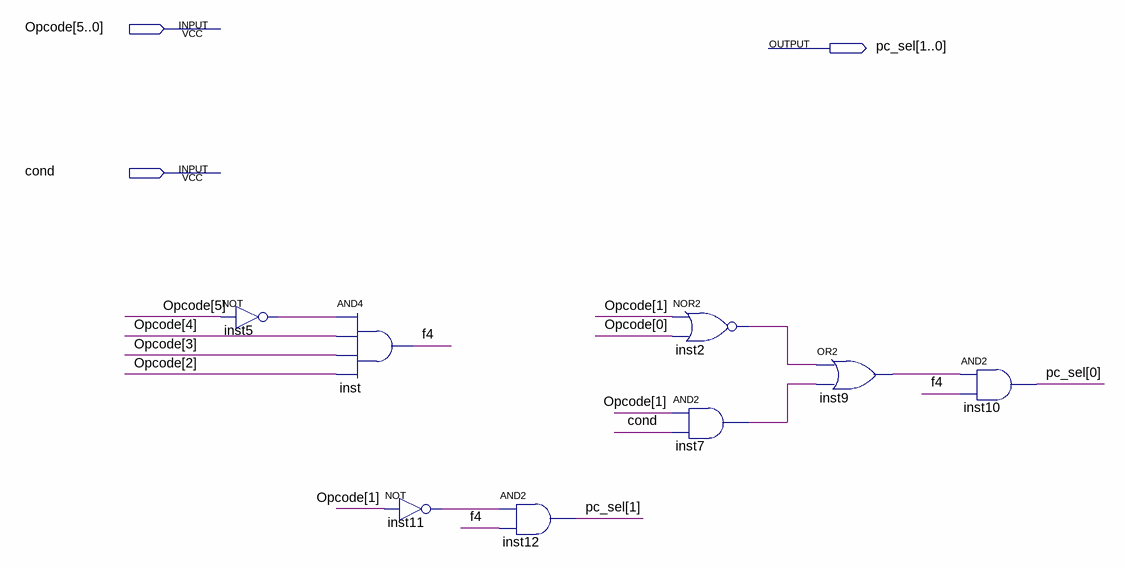
[diagram p0: schematic sheet]
// Quartus schematic PC_selector.bdf as structural Verilog: 8 symbols, 3 pins
module PC_selector (
  input  [5:0] Opcode,
  input  cond,
  output [1:0] pc_sel
);

  wire f4, inst2_out, inst5_out, inst7_out, inst9_out, inst11_out;

  not inst5 (inst5_out, Opcode[5]);
  and inst (f4, inst5_out, Opcode[4], Opcode[3], Opcode[2]);
  not inst11 (inst11_out, Opcode[1]);
  and inst12 (pc_sel[1], inst11_out, f4);
  nor inst2 (inst2_out, Opcode[1], Opcode[0]);
  and inst7 (inst7_out, Opcode[1], cond);
  or inst9 (inst9_out, inst2_out, inst7_out);
  and inst10 (pc_sel[0], inst9_out, f4);
endmodule
